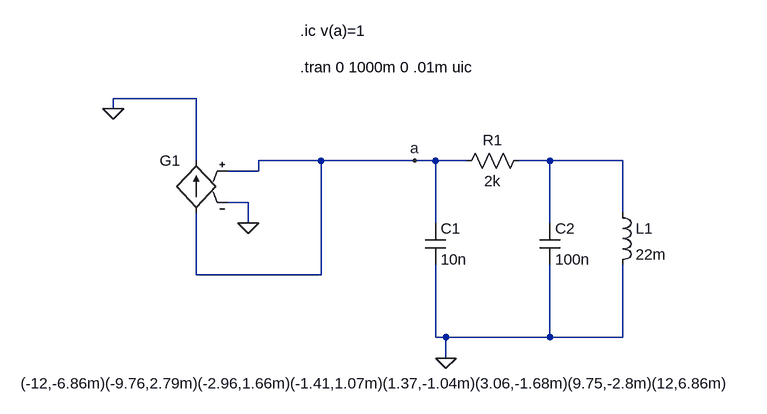
[diagram p0: schematic chua2.asc]
chua2.asc, the LTspice schematic file:
Version 4
SHEET 1 1624 680
WIRE 416 -96 288 -96
WIRE 288 -80 288 -96
WIRE 416 0 416 -96
WIRE 608 0 512 0
WIRE 752 0 608 0
WIRE 784 0 752 0
WIRE 832 0 784 0
WIRE 960 0 912 0
WIRE 1072 0 960 0
WIRE 512 16 512 0
WIRE 512 16 464 16
WIRE 496 64 464 64
WIRE 1072 80 1072 0
WIRE 496 96 496 64
WIRE 784 96 784 0
WIRE 960 96 960 0
WIRE 416 176 416 80
WIRE 608 176 608 0
WIRE 608 176 416 176
WIRE 784 272 784 160
WIRE 800 272 784 272
WIRE 960 272 960 160
WIRE 960 272 800 272
WIRE 1072 272 1072 160
WIRE 1072 272 960 272
WIRE 800 304 800 272
FLAG 800 304 0
FLAG 752 0 a
FLAG 496 96 0
FLAG 288 -80 0
SYMBOL cap 768 96 R0
SYMATTR InstName C1
SYMATTR Value 10n
SYMBOL cap 944 96 R0
SYMATTR InstName C2
SYMATTR Value 100n
SYMBOL res 928 -16 R90
WINDOW 0 0 56 VBottom 2
WINDOW 3 32 56 VTop 2
SYMATTR InstName R1
SYMATTR Value 2k
SYMBOL ind 1056 64 R0
SYMATTR InstName L1
SYMATTR Value 22m
SYMBOL g 416 -16 M0
WINDOW 3 -846 359 Left 2
SYMATTR Value (-12,-6.86m)(-9.76,2.79m)(-2.96,1.66m)(-1.41,1.07m)(1.37,-1.04m)(3.06,-1.68m)(9.75,-2.8m)(12,6.86m)
SYMATTR InstName G1
SYMATTR SpiceModel table
TEXT 576 -200 Left 2 !.ic v(a)=1
TEXT 576 -144 Left 2 !.tran 0 1000m 0 .01m uic

The netlist it stands for:
* chua2.asc
C1 a 0 10n
C2 N001 0 100n
R1 N001 a 2k
L1 N001 0 22m
G1 a 0 a 0 table (-12,-6.86m)(-9.76,2.79m)(-2.96,1.66m)(-1.41,1.07m)(1.37,-1.04m)(3.06,-1.68m)(9.75,-2.8m)(12,6.86m)
.ic v(a)=1
.tran 0 1000m 0 .01m uic
.backanno
.end